# EAGLE design V4-AddOnESP32-V02-011 (EAGLE 9.1.1)
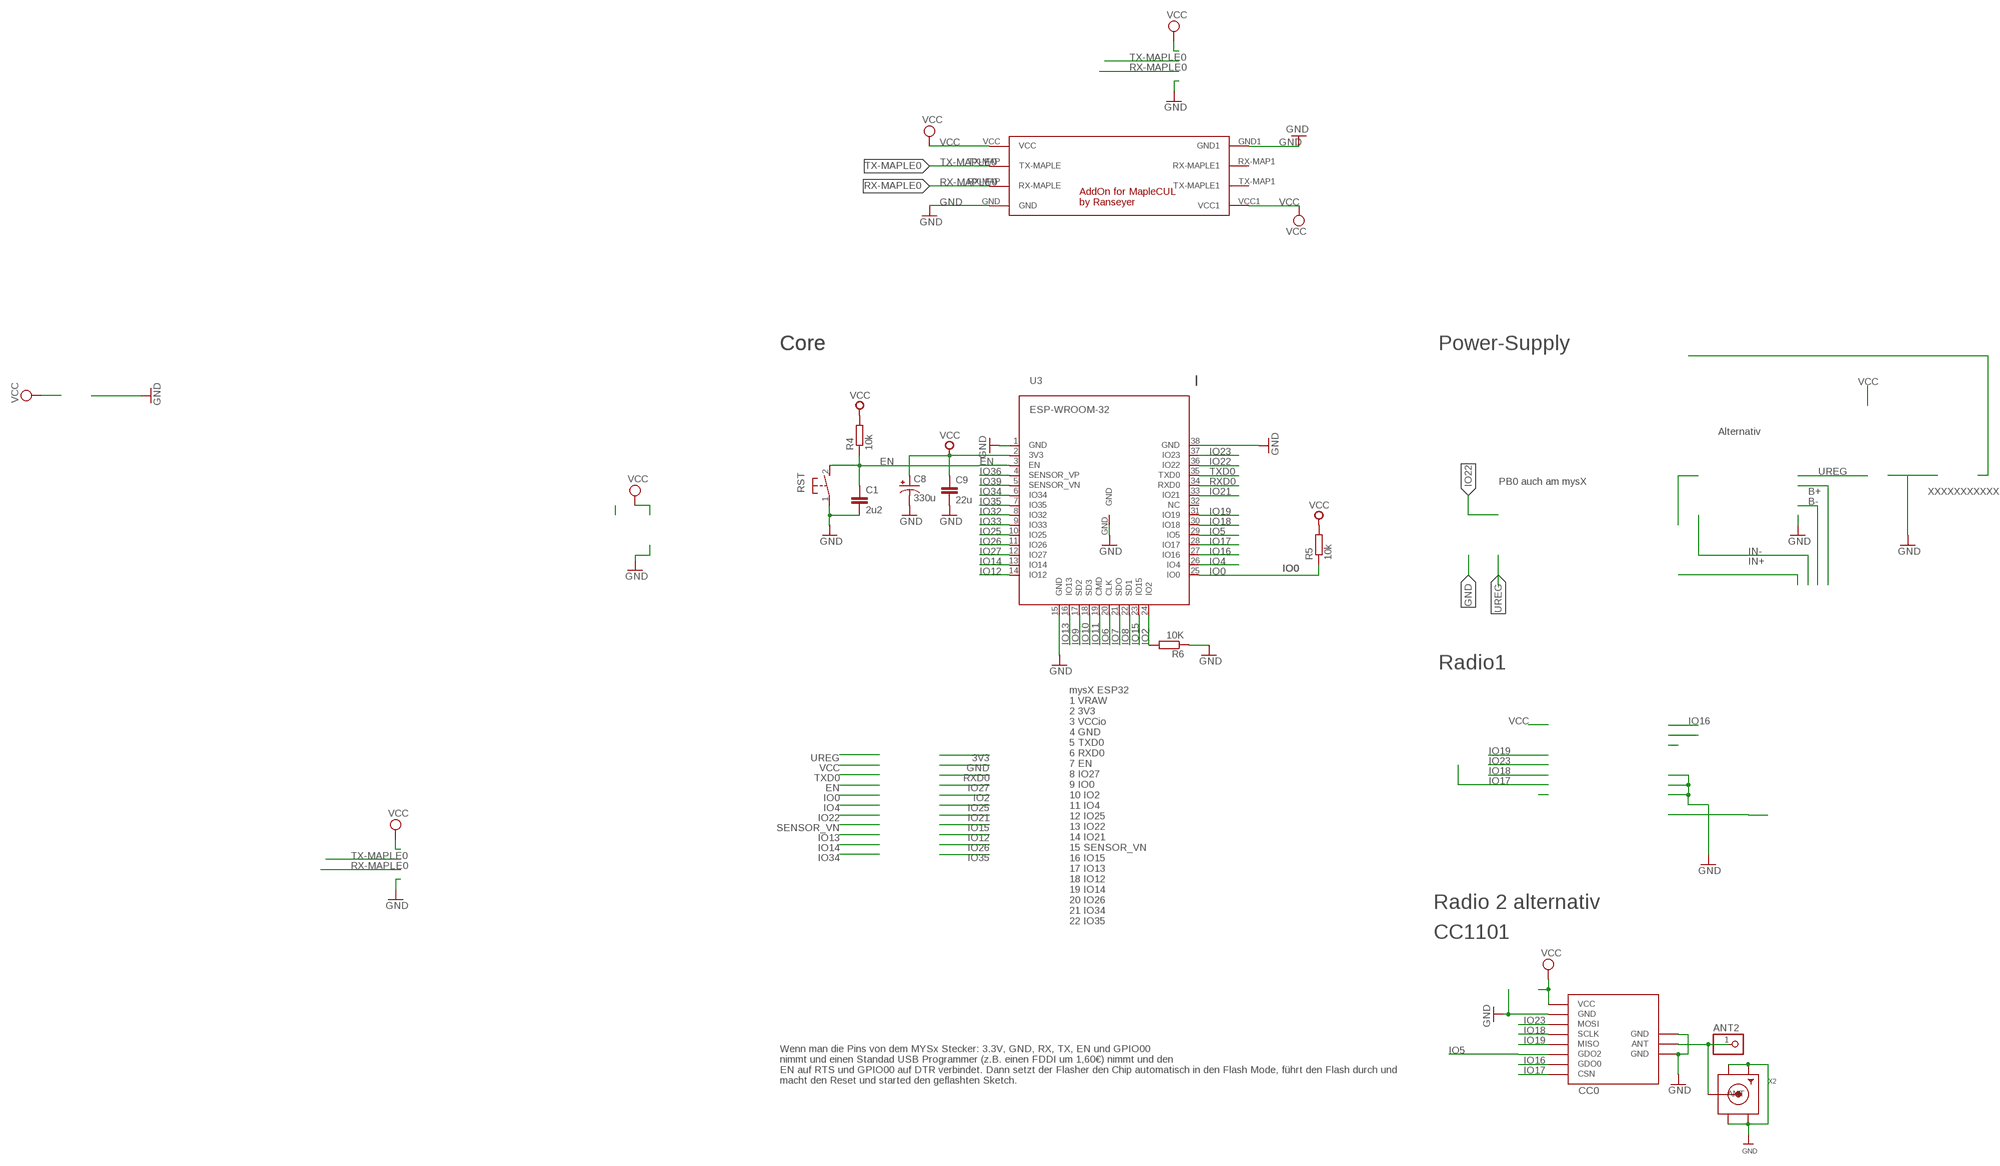
[diagram p0: schematic, sheet 1]

## Parts
ANT2  PINHD-1X1  [1X01]
C1  2u2  C-EUC0805  [C0805]
C8  330u  CAP_POLSMD  [VISHAY_C]
C9  22u  C-EUC0805  [C0805]
CC0  CC1101  CC1101_MODULE1SMD  [CC1101_MODULE1_SMD]
R4  10k  R-EU_M0805  [M0805]
R5  10k  R-EU_M0805  [M0805]
R6  10K  R-EU_M0805  [M0805]
RST  DTSM-3  [DTSM-3]
U3  ESP-WROOM-32  [ESP-WROOM-32]
U$2  MAPLE-CUL-ADDON-V01  [MAPLE-CUL-V01]
X2  SMACONNECTOR_EDGE  [SMA_EDGELAUNCH]

## Nets
ANT0: ANT2.1 CC0.ANT X2.P(ANT)
EN: C1.1 R4.1 RST.2 U3.3(EN)
GND [PWR]: C1.2 C8.- C9.2 CC0.GND@0(GND) CC0.GND@1(GND) CC0.GND@2(GND) R6.1 RST.1 U3.1(GND) U3.15(GND) U3.38(GND) U3.GND U$2.GND U$2.GND1 X2.GND@1(GND4) X2.GND@2(GND3) X2.GND@3(GND2) X2.GND@4(GND1)
IO0: R5.1 U3.25(IO0)
IO2: R6.2 U3.24(IO2)
IO4: U3.26(IO4)
IO5: CC0.GDO2 U3.29(IO5)
IO6: U3.20(CLK)
IO7: U3.21(SDO)
IO8: U3.22(SD1)
IO9: U3.17(SD2)
IO10: U3.18(SD3)
IO11: U3.19(CMD)
IO12: U3.14(IO12)
IO13: U3.16(IO13)
IO14: U3.13(IO14)
IO15: U3.23(IO15)
IO16: CC0.GDO0 U3.27(IO16)
IO17: CC0.CSN U3.28(IO17)
IO18: CC0.SCLK U3.30(IO18)
IO19: CC0.MISO U3.31(IO19)
IO21: U3.33(IO21)
IO22: U3.36(IO22)
IO23: CC0.MOSI U3.37(IO23)
IO25: U3.10(IO25)
IO26: U3.11(IO26)
IO27: U3.12(IO27)
IO32: U3.8(IO32)
IO33: U3.9(IO33)
IO34: U3.6(IO34)
IO35: U3.7(IO35)
IO36: U3.4(SENSOR_VP)
IO39: U3.5(SENSOR_VN)
RX-MAPLE0: U$2.RX-MAP(RX-MAPLE)
RXD0: U3.34(RXD0)
TX-MAPLE0: U$2.TX-MAP(TX-MAPLE)
TXD0: U3.35(TXD0)
VCC [PWR]: C8.+ C9.1 CC0.VCC R4.2 R5.2 U3.2(3V3) U$2.VCC U$2.VCC1
Unconnected: U3.32(NC) U$2.RX-MAP1(RX-MAPLE1) U$2.TX-MAP1(TX-MAPLE1)

## Notes on the sheet
- Core | Core | Power-Supply
- Alternativ
- PB0 auch am mysX
- XXXXXXXXXXX
- Radio1
- Radio 2 alternativ
- mysX ESP32
  1 VRAW
  2 3V3
  3 VCCio
  4 GND
  5 TXD0
  6 RXD0
  7 EN
  8 IO27
  9 IO0
  10 IO2
  11 IO4
  12 IO25
  13 IO22
  14 IO21
  15 SENSOR_VN
  16 IO15
  17 IO13
  18 IO12
  19 IO14
  20 IO26
  21 IO34
  22 IO35
- CC1101
- Wenn man die Pins von dem MYSx Stecker: 3.3V, GND, RX, TX, EN und GPIO00
  nimmt und einen Standad USB Programmer (z.B. einen FDDI um 1,60€) nimmt und den
  EN auf RTS und GPIO00 auf DTR verbindet. Dann setzt der Flasher den Chip automatisch in den Flash Mode, führt den Flash durch und
  macht den Reset und started den geflashten Sketch.

## Library data of the parts
ANT2 = pinhead:PINHD-1X1: PIN HEADER
C1 C9 = rcl@1:C-EU: CAPACITOR, European symbol; SPICEPREFIX: C
C8 = SparkFun-Passives:CAP_POL: Capacitor Polarized These are standard SMD and PTH capacitors. Normally 10uF, 47uF, and 100uF in electrolytic and tantalum varieties. Always verify the external diameter of the through hole cap, it varies with capacity, voltage, and manufacturer. The EIA devices should be standard.
CC0 = wireless:CC1101_MODULE1: CC1101 wireless module for 433/868 MHz (sold from Aliexpress). DIL version for mounting with pin header (and SMD soldering) and SMD only variant available.
R4 = rcl@1:R-EU_: RESISTOR, European symbol; SPICEPREFIX: R
R5 = rcl:R-EU_: RESISTOR, European symbol; SPICEPREFIX: R
R6 = rcl:R-EU_: RESISTOR, European symbol
RST = switch-tact:DTSM-3
U3 = esp32:ESP-WROOM-32
U$2 = Martin-Communication-V4:MAPLE-CUL-ADDON-V01: AddOn for MAPLE-CUL V4.x
X2 = adafruit:SMACONNECTOR: SMA Connector 90° DIP SMA Connector, 50 Ohm (4UConnector: 07259)

## Net classes
0 default: width 0.406 mm
1 PWR: width 0.61 mm
2 vcc: width 0.61 mm, drill 0.406 mm, clearance 0.254 mm

## Board
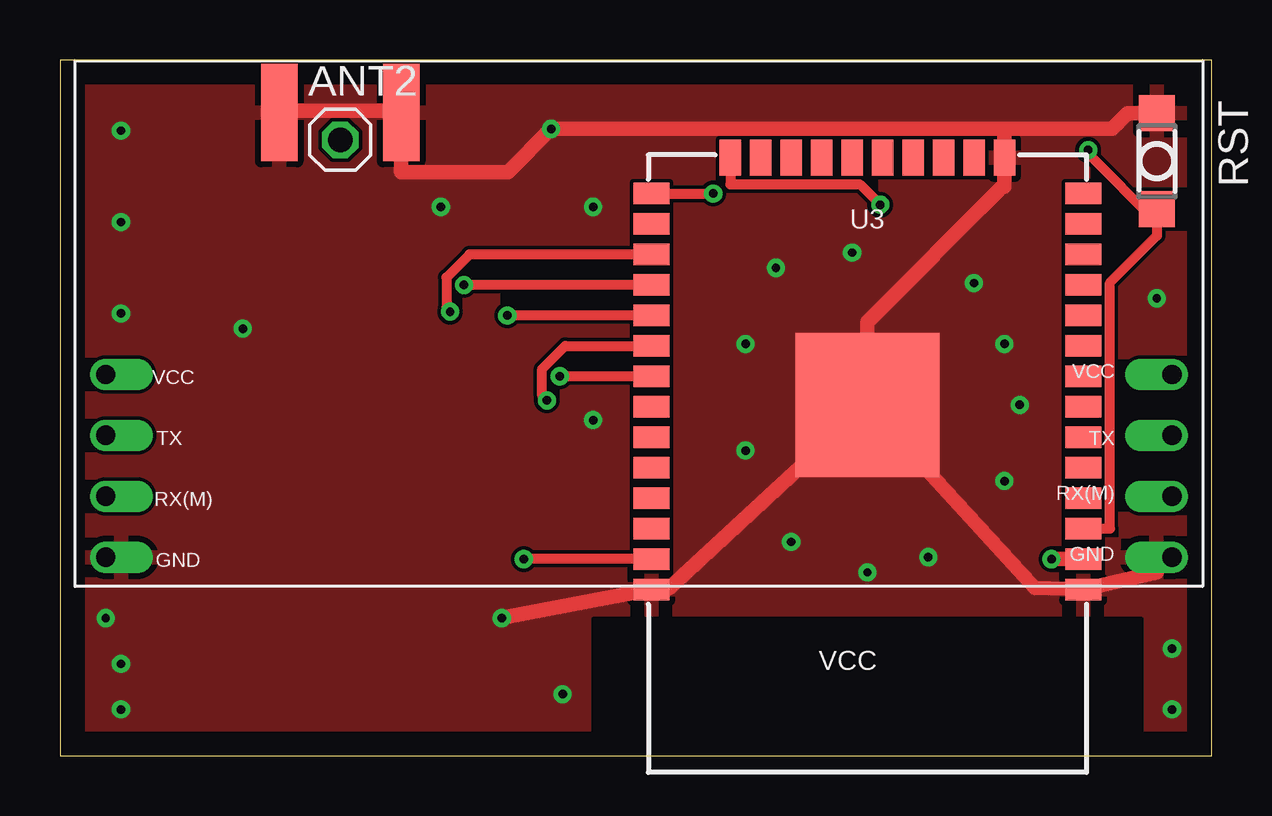
[diagram p1: board, top side]
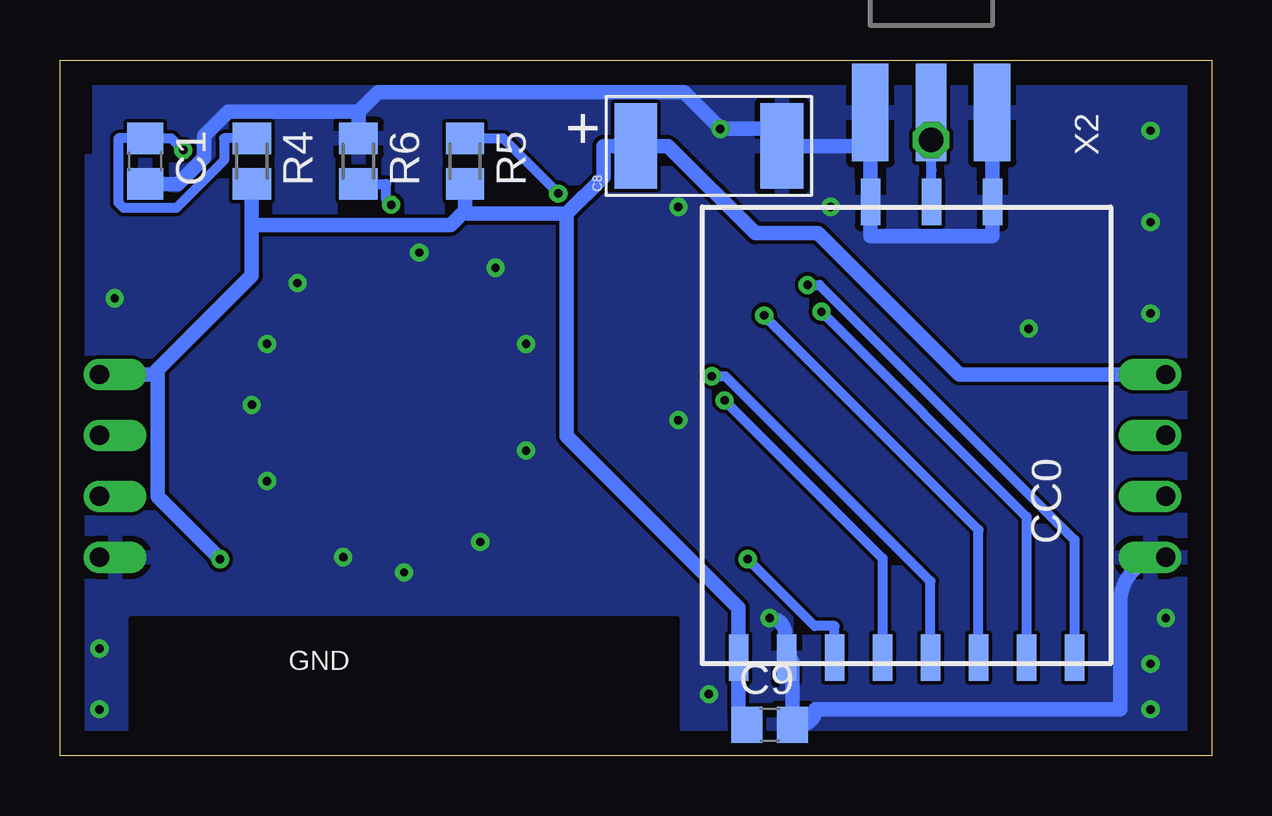
[diagram p2: board, bottom side, seen from below]

Size 48 x 29 mm. Coordinates in mm from the lower left corner, seen from the top.
Outline: 0,0 48,0 48,29 0,29 0,0
Copper layers (1*16): Top 0.035mm / dielectric 1.5mm / Bottom 0.035mm
Design rules "default": minimum track width 6mil, minimum drill 0.35mm, track to track 6mil, track to pad 6mil, pad to pad 6mil, via to via 6mil, smd to smd 6mil, copper to edge 40mil, drill to drill 6mil, minimum pad ring 10mil, minimum via ring 8mil, stop-mask expansion 4mil, vias tented up to drill 0mil, thermal gap 10mil

### Footprints (pad centres in the part's own frame; a part is rotated, then mirrored left to right if it is on the bottom)
1X01 = drill 1.016 octagon: 1 0,0
C0805 = smd 1.3 x 1.5: 1 -0.95,0; 2 0.95,0
VISHAY_C = smd 3.556 x 1.778: + 0,3.048; - 0,-3.048
CC1101_MODULE1_SMD = smd 1.93 x 0.813: ANT 19,5.96; CSN 0,0; GDO0 0,2; GDO2 0,4; GND@0 0,12; GND@1 19,8.5; GND@2 19,3.42; MISO 0,6; MOSI 0,10; SCLK 0,8; VCC 0,14
M0805 = smd 1.3 x 1.6: 1 -0.95,0; 2 0.95,0
DTSM-3 = smd 1.5 x 1.5: 1 -2,0; 2 2,0
ESP-WROOM-32 = smd 0.9 x 1.5: 1 7.7,9; 2 6.43,9; 3 5.16,9; 4 3.89,9; 5 2.62,9; 6 1.35,9; 7 0.08,9; 8 -1.19,9; 9 -2.46,9; 10 -3.73,9; 11 -5,9; 12 -6.27,9; 13 -7.54,9; 14 -8.81,9; 25 -8.81,-9; 26 -7.54,-9; 27 -6.27,-9; 28 -5,-9; 29 -3.73,-9; 30 -2.46,-9; 31 -1.19,-9; 32 0.08,-9; 33 1.35,-9; 34 2.62,-9; 35 3.89,-9; 36 5.16,-9; 37 6.43,-9; 38 7.7,-9 | smd 1.5 x 0.9: 15 -10.3,5.715; 16 -10.3,4.445; 17 -10.3,3.175; 18 -10.3,1.905; 19 -10.3,0.635; 20 -10.3,-0.635; 21 -10.3,-1.905; 22 -10.3,-3.175; 23 -10.3,-4.445; 24 -10.3,-5.715 | smd 6 x 6: GND 0,0
MAPLE-CUL-V01 = drill 0.8 offset: GND 1.27,12.7; GND1 45.72,12.7; RX-MAP 1.27,10.16; RX-MAP1 45.72,10.16; TX-MAP 1.27,7.62; TX-MAP1 45.72,7.62; VCC 1.27,5.08; VCC1 45.72,5.08
SMA_EDGELAUNCH = smd 4.064 x 1.524: GND@1 2.032,-2.54; GND@2 2.032,2.54 | smd 4.064 x 1.524 bottom: GND@3 2.032,2.54; GND@4 2.032,-2.54 | smd 4.064 x 1.27: P 2.032,0

### Placement (x,y rotation side)
ANT2  11.68,25.67 0 top
C1  44.45,24.78 270 bottom
C8  20.95,25.41 90 bottom
C9  18.41,1.29 0 bottom
CC0  5.71,4.08 90 bottom
R4  40.01,24.78 270 bottom
R5  31.11,24.78 270 bottom
R6  35.56,24.78 270 bottom
RST  45.72,24.78 270 top
U3  33.66,14.62 270 top
U$2  47.62,20.97 180 top
X2  11.68,28.84 270 bottom

### Tracks (layer width: path | path; a pad name or v marks a point on that pad's centre or on a via)
ANT0
  Bottom 0.406: CC0.ANT 11.68,24.4 11.68,24.41 ANT2.1 X2.P
EN  (via drill 0.35 pad 0.76)
  Top 0.406: 45.72,22.23 42.86,25.09 v42.86,25.25 | 45.72,22.23 45.72,21.67 43.76,19.71 43.76,9.46 U3.3 | RST.2 45.72,22.23
  Bottom 0.406: R4.1 41.16,25.73 41.16,24.82 43.16,22.82 45.35,22.82 45.56,23.03 45.56,25.73 C1.1 43.34,25.73 v42.86,25.25
GND  (via drill 0.35 pad 0.76)
  Top 0.61: U3.GND 33.66,16.35 33.66,18.08 39.29,23.71 39.37,23.71 U3.15 39.37,25.43 39.37,25.94 39.37,26.13 | 39.37,26.13 v20.48,26.13 18.67,24.32 14.22,24.32 X2.GND@1 14.14,26.89 9.22,26.89 X2.GND@2 | RST.1 44.51,26.78 43.86,26.13 39.37,26.13 | U3.GND 25.4,7 U3.38 v18.41,5.73 | U3.GND 40.64,7 U3.1 45.72,7.63 45.72,8.27 U$2.GND
  Bottom 0.61: 17.23,25.41 17.95,26.13 v20.48,26.13 22,27.65 34.75,27.65 35.56,26.84 | 17.23,25.41 16.56,25.41 14.22,25.41 | C8.- 17.23,25.41 | 14.22,25.41 14.22,24.51 14.21,24.5 CC0.GND@1 14.21,21.66 9.13,21.66 CC0.GND@2 9.13,24.31 9.14,24.32 X2.GND@2 | X2.GND@1 14.22,25.41 | R6.1 35.56,26.84 | 35.56,26.84 41,26.84 41.99,25.84 41.99,24.93 43.09,23.83 C1.2 | v18.41,5.73 arc90 17.78,5.09 17.78,4.46 arc90 17.71,4.39 CC0.GND@0 arc90 17.46,3.83 C9.2 17.14,1.29 arc-90 16.51,1.92 3.81,1.92 3.81,6.37 arc90 U$2.GND1
  other vias: 2.54,26.05 2.54,22.24 2.54,18.43 1.91,5.73 2.54,1.92 2.54,3.83 7.62,17.8 20.95,2.55 22.23,13.98 22.23,22.88 15.88,22.88 29.84,20.34 28.57,17.16 28.57,12.71 30.48,8.9 33.66,7.63 36.2,8.27 39.37,11.45 40.01,14.62 39.37,17.16 38.1,19.7 33.02,20.97 45.72,19.06 46.35,4.46 46.35,1.92
  pour Bottom: 0.64,0.65 0.64,27.95 46.35,27.95 46.35,24.78 46.99,24.78 46.99,0.65
  pour Top: 0.64,27.95 46.99,27.95 46.99,0.65 0.64,0.65
IO0  (via drill 0.35 pad 0.76)
  Top 0.406: U3.25 v27.23,23.43
  Bottom 0.406: R5.1 29.53,25.73 v27.23,23.43
IO2  (via drill 0.35 pad 0.76)
  Top 0.406: U3.24 27.94,23.81 33.34,23.81 v34.19,22.96
  Bottom 0.406: R6.2 34.4,23.83 34.4,23.18 v34.19,22.96
IO5  (via drill 0.35 pad 0.76)
  Top 0.406: U3.29 v18.65,18.35
  Bottom 0.406: CC0.GDO2 9.71,9.42 v18.65,18.35
IO16  (via drill 0.35 pad 0.76)
  Top 0.406: U3.27 17.06,20.89 16.11,19.93 16.11,18.66 v16.26,18.5
  Bottom 0.406: v16.26,18.5 7.71,9.96 CC0.GDO0
IO17  (via drill 0.35 pad 0.76)
  Top 0.406: U3.28 v16.84,19.62
  Bottom 0.406: v16.84,19.62 16.34,19.62 5.71,9 CC0.CSN
IO18  (via drill 0.35 pad 0.76)
  Top 0.406: v20.3,14.81 20.1,15.01 20.1,16.12 21.06,17.08 U3.30
  Bottom 0.406: v20.3,14.81 13.71,8.22 CC0.SCLK
IO19  (via drill 0.35 pad 0.76)
  Top 0.406: U3.31 v20.83,15.81
  Bottom 0.406: CC0.MISO 11.71,7.26 20.26,15.81 v20.83,15.81
IO23  (via drill 0.35 pad 0.76)
  Top 0.406: U3.37 v19.34,8.19
  Bottom 0.406: CC0.MOSI 15.71,5.4 16.55,5.4 v19.34,8.19
VCC  (via drill 0.35 pad 0.76)
  Top 0.61: U3.2 v41.33,8.19
  Bottom 0.61: 26.88,22.59 26.88,13.33 19.71,6.17 CC0.VCC 19.71,1.63 arc-90 C9.1 | 26.88,22.59 25.35,24.12 25.35,25.41 C8.+ 22.66,25.41 19.02,21.78 16.4,21.78 10.51,15.89 U$2.VCC1 | 31.11,22.72 30.98,22.59 26.88,22.59 | 40.01,22.12 31.71,22.12 31.11,22.72 | 40.01,22.12 R4.2 | 44.13,15.89 40.01,20.01 40.01,22.12 | R5.2 31.11,22.72 | 44.13,15.89 43.94,15.89 43.94,10.8 v41.33,8.19 | U$2.VCC 44.13,15.89

### Text on the board
tNames: VCC
bNames: GND